# Altium schematic sheet v9881dmach.SchDoc
size A
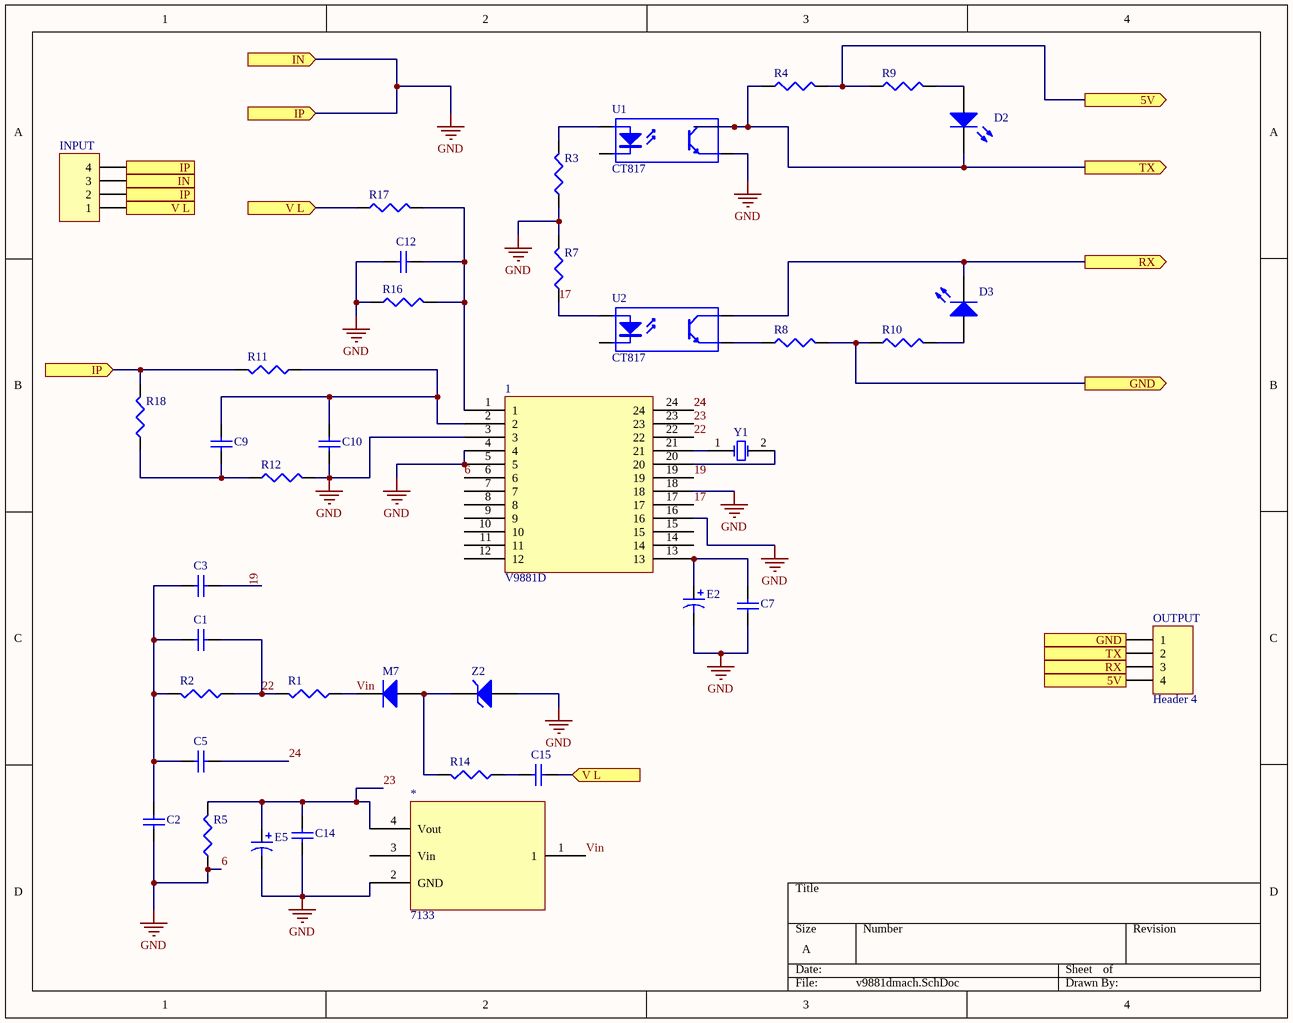
[diagram p0: v9881dmach.SchDoc]

## Parts
1  V9881D
*  7133
C1  Cap  [RAD-0.3]  (value not drawn)
C2  Cap  [RAD-0.3]  (value not drawn)
C3  Cap  [RAD-0.3]  (value not drawn)
C5  Cap  [RAD-0.3]  (value not drawn)
C7  Cap  [RAD-0.3]  (value not drawn)
C9  Cap  [RAD-0.3]  (value not drawn)
C10  Cap  [RAD-0.3]  (value not drawn)
C12  Cap  [RAD-0.3]  (value not drawn)
C14  Cap  [RAD-0.3]  (value not drawn)
C15  Cap  [RAD-0.3]  (value not drawn)
D2  LED0  [LED-0]  (value not drawn)
D3  LED0  [LED-0]  (value not drawn)
E2  Cap Pol1  [RB7.6-15]  (value not drawn)
E5  Cap Pol1  [RB7.6-15]  (value not drawn)
INPUT  Header 4  [HDR1X4]  (value not drawn)
M7  Diode  [SMC]  (value not drawn)
OUTPUT  Header 4  [HDR1X4]
R1  Res  [J1-0603]  (value not drawn)
R2  Res  [J1-0603]  (value not drawn)
R3  Res  [J1-0603]  (value not drawn)
R4  Res  [J1-0603]  (value not drawn)
R5  Res  [J1-0603]  (value not drawn)
R7  Res  [J1-0603]  (value not drawn)
R8  Res  [J1-0603]  (value not drawn)
R9  Res  [J1-0603]  (value not drawn)
R10  Res  [J1-0603]  (value not drawn)
R11  Res  [J1-0603]  (value not drawn)
R12  Res  [J1-0603]  (value not drawn)
R14  Res  [J1-0603]  (value not drawn)
R16  Res  [J1-0603]  (value not drawn)
R17  Res  [J1-0603]  (value not drawn)
R18  Res  [J1-0603]  (value not drawn)
U1  CT817  [DIP-4]
U2  CT817  [DIP-4]
Y1  XTAL  [R38]  (value not drawn)
Z2  D Zener  [DIODE-0.7]  (value not drawn)

## Ports
5V (out), GND (out), IN (in), IP (in), RX (out), TX (out), V L (in)

## Nets
6: 1.3 1.4 1.5 1.6 1.16 1.18 *.2(GND) C2.1 C7.2 C10.2 C12.1 C14.2 E2.2 E5.2 INPUT.2 INPUT.3 INPUT.4 R3.1 R5.1 R7.2 R11.2 R12.2 R16.1 R18.2 U1.3(E) Z2.1(A) ; port IP, port IN  [also labelled GND]
5V: OUTPUT.4 R4.2 R9.1 ; port 5V
17: 1.17 R7.1 U2.1(A)
19: 1.19 C3.1
22: 1.22 C1.1 R1.2 R2.1
23: 1.23 *.4(Vout) C14.1 E5.1 R5.2
24: 1.24 C5.1
GND: OUTPUT.1 R8.2 R10.1 ; port GND
RX: D3.2(K) OUTPUT.3 U2.4(C) ; port RX
TX: D2.2(K) OUTPUT.2 R4.1 U1.4(C) ; port TX
V L: C15.1 INPUT.1 R17.1 ; port V L
Vin: *.1 M7.2(K) R1.1
Net1_1: 1.1 C12.2 R16.2 R17.2
Net1_2: 1.2 C9.2 C10.1 R11.1
Net1_13: 1.13 C7.1 E2.1
Net1_20: 1.20 Y1.2(OSC2)
Net1_21: 1.21 Y1.1(OSC1)
NetC1_2: C1.2 C2.2 C3.2 C5.2 R2.2
NetC9_1: C9.1 R12.1 R18.1
NetC15_2: C15.2 R14.1
NetD2_1: D2.1(A) R9.2
NetD3_1: D3.1(A) R10.2
NetM7_1: M7.1(A) R14.2 Z2.2(K)
NetR3_2: R3.2 U1.1(A)
NetR8_1: R8.1 U2.3(E)

Not connected (* = marked no-connect by the designer): 1 7 8 9 10 11 12 14 15; * 3(Vin); U1 2(K); U2 2(K)

## Library data of the parts
C1-C3 C5 C7 C9 C10 C12 C14 C15 = Cap: Capacitor; Value: 100pF; Published: 8-Jun-2000; LatestRevisionDate: 17-Jul-2002; LatestRevisionNote: Re-released for DXP Platform.; PackageReference: RAD-0.3; Publisher: Altium Limited; PackageDescription: Radial Cap, Thru-Hole; 2 Leads; 0.3 in Pin Spacing
D2 D3 = LED0: Typical INFRARED GaAs LED; Published: 8-Jun-2000; LatestRevisionDate: 08-Jul-2005; LatestRevisionNote: Mech Layer 1 removed.; PackageReference: LED-0; Publisher: Altium Limited; PackageDescription: LED; 2 Leads
E2 E5 = Cap Pol1: Polarized Capacitor (Radial); Value: 100pF; Published: 8-Jun-2000; LatestRevisionDate: 17-Jul-2002; LatestRevisionNote: Re-released for DXP Platform.; PackageReference: RB7.6-15; Publisher: Altium Limited; PackageDescription: Polarized Capacitor (Radial); 2 Leads
INPUT OUTPUT = Header 4: Header, 4-Pin; LatestRevisionDate: 17-Jul-2002; LatestRevisionNote: Re-released for DXP Platform.; Publisher: Altium Limited
M7 = Diode: Default Diode; Published: 8-Jun-2000; LatestRevisionDate: 17-Jul-2002; LatestRevisionNote: Re-released for DXP Platform.; PackageVersion: Sep-1996; PackageReference: SMC; Publisher: Altium Limited; PackageDescription: DO-214-AB/SMC; 2 C-Bend Leads; Body 7.9 x 5.9 mm, inc. leads (LxW); Code_JEDEC: DO-214-AB
R1-R5 R7-R12 R14 R16-R18 = Res3: Resistor; Value: 1K; Published: 8-Jun-2000; LatestRevisionDate: 29-May-2009; LatestRevisionNote: IPC-7351 Footprint Added.; PackageReference: J1-0603; Publisher: Altium Limited; PackageDescription: Chip Resistor
U1 U2 = Optoisolator1: 4-Pin Phototransistor Optocoupler; Published: 24-Mar-1999; LatestRevisionDate: 04-Mar-2005; LatestRevisionNote: Sch pins 3 & 4 Swapped.; DatasheetVersion: Nov-2003; PackageReference: DIP-4; Publisher: Altium Limited
Y1 = XTAL: Crystal Oscillator; Published: 8-Jun-2000; LatestRevisionDate: 17-Jul-2002; LatestRevisionNote: Re-released for DXP Platform.; PackageReference: R38; Publisher: Altium Limited; PackageDescription: Crystal, Thru-Hole; 2 Leads; Body 3.1 x 8.2 mm (Dia.xH)
Z2 = D Zener: Zener Diode; Published: 8-Jun-2000; LatestRevisionDate: 17-Jul-2002; LatestRevisionNote: Re-released for DXP Platform.; PackageReference: DIODE-0.7; Publisher: Altium Limited; PackageDescription: Diode, Thru-Hole; 2 Leads; 0.7 in Pin Spacing